# EAGLE design spectrometer (EAGLE 7.4.0)
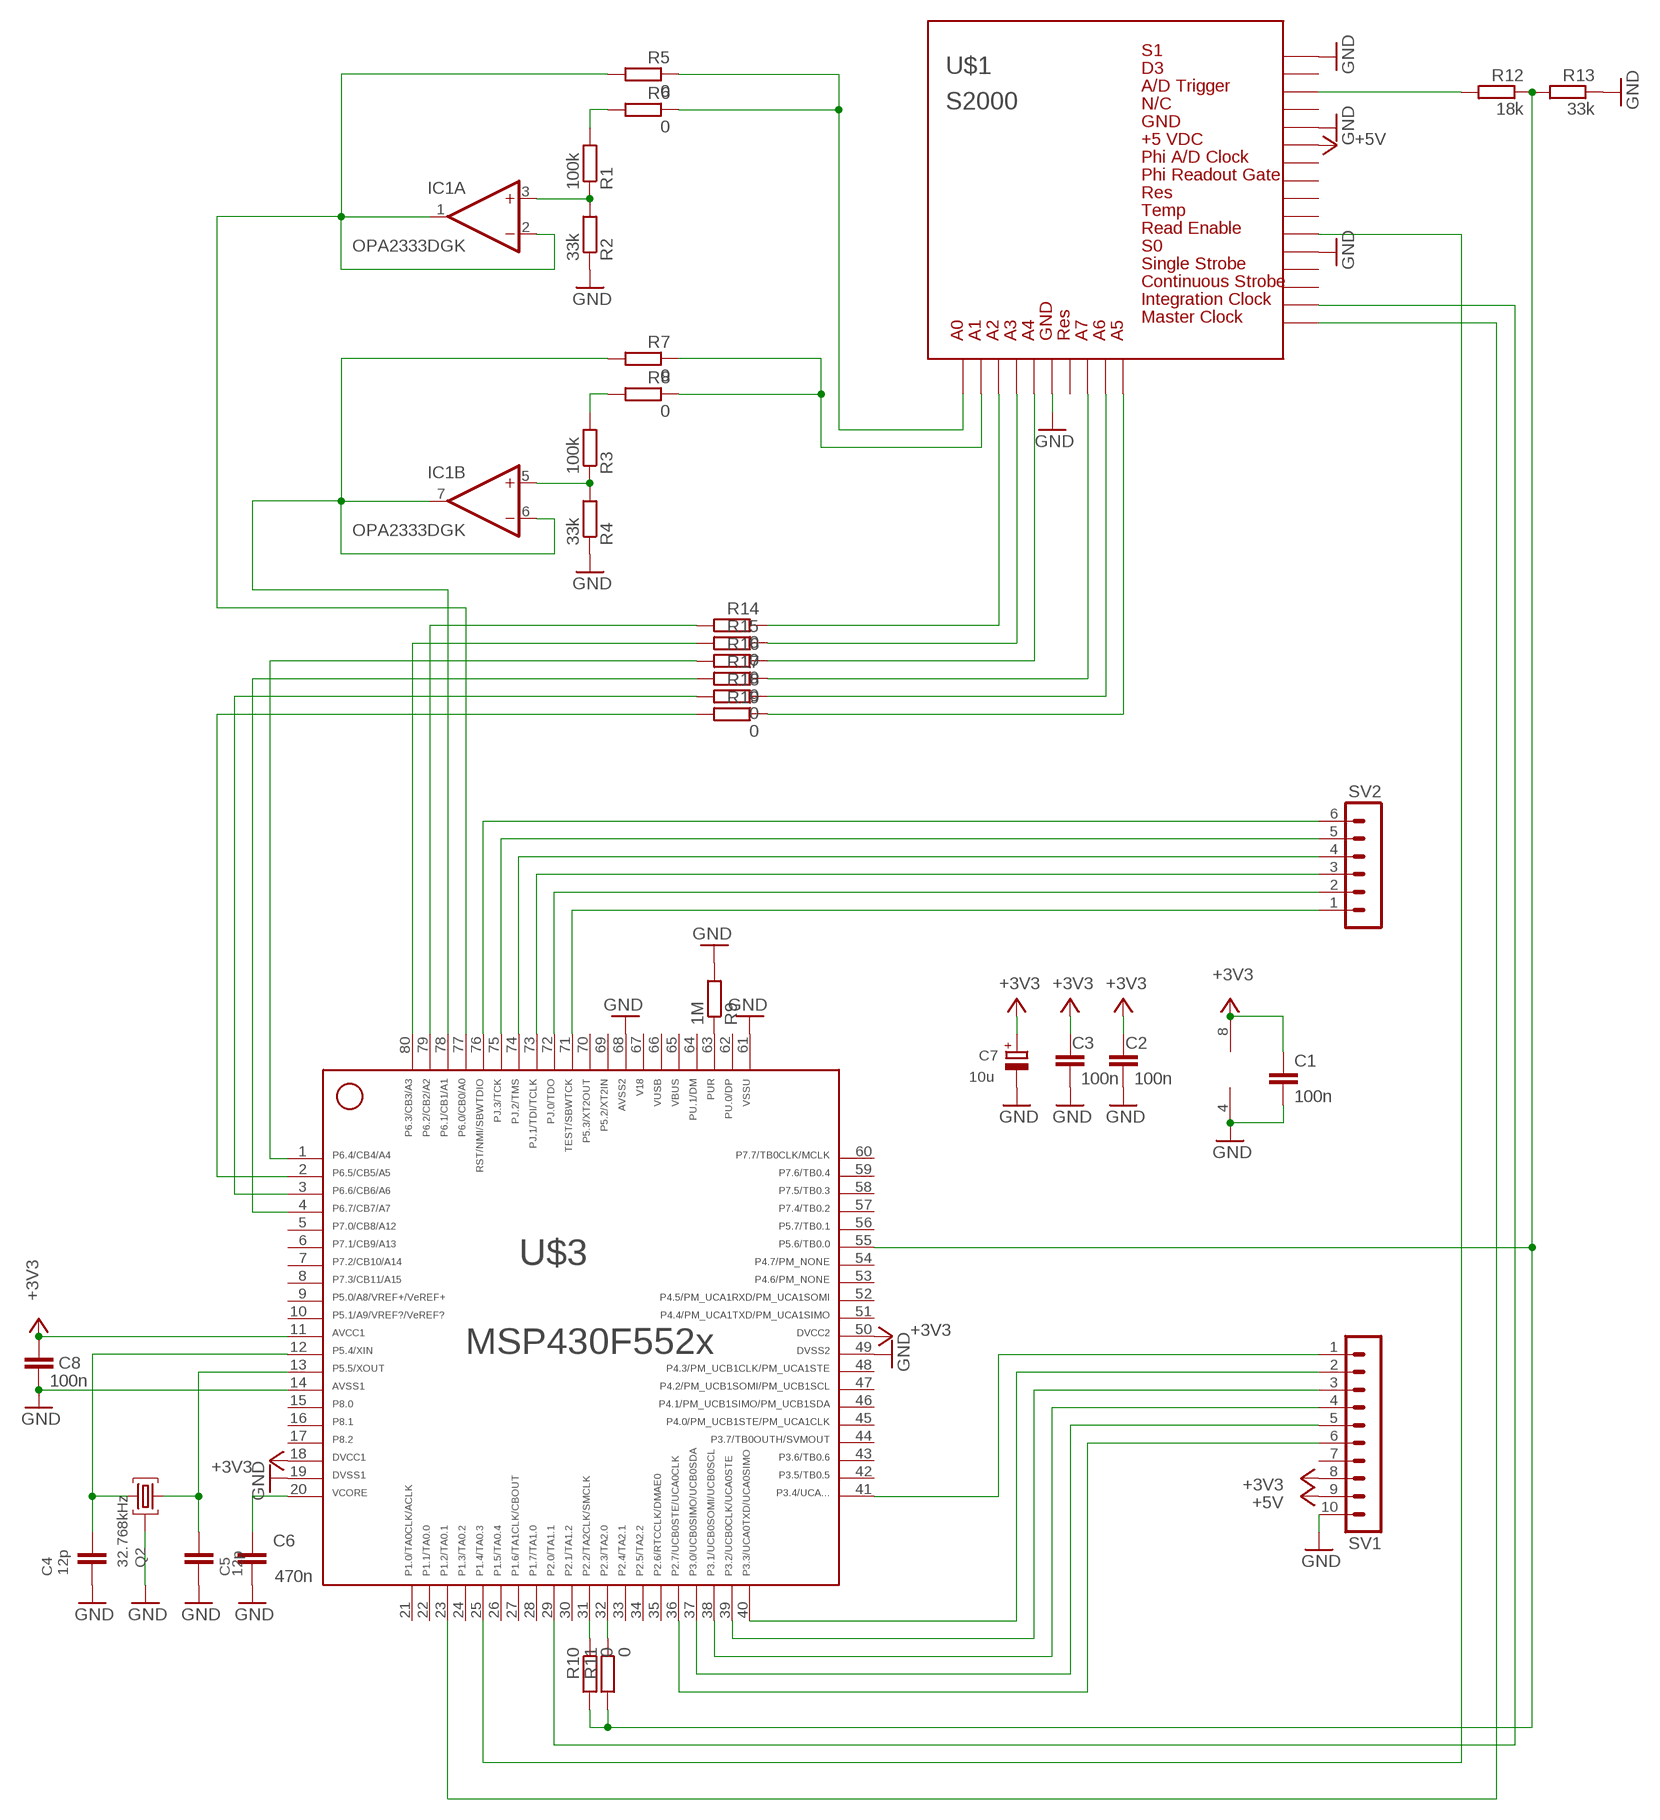
[diagram p0: schematic, sheet 1]

## Parts
C1  100n  C-EUC0603  [C0603]
C2  100n  C-EUC0603  [C0603]
C3  100n  C-EUC0603  [C0603]
C4  12p  C-EUC0603  [C0603]
C5  12p  C-EUC0603  [C0603]
C6  470n  C-EUC0603  [C0603]
C7  10u  CPOL-EUA/3216-18R  [A/3216-18R]
C8  100n  C-EUC0603  [C0603]
IC1  OPA2333DGK  [MSOP08]
Q2  32.768kHz  MS3V-T1R  [MS3V-T1R]
R1  100k  R-EU_R0603  [R0603]
R2  33k  R-EU_R0603  [R0603]
R3  100k  R-EU_R0603  [R0603]
R4  33k  R-EU_R0603  [R0603]
R5  0  R-EU_R0603  [R0603]
R6  0  R-EU_R0603  [R0603]
R7  0  R-EU_R0603  [R0603]
R8  0  R-EU_R0603  [R0603]
R9  1M  R-EU_R0603  [R0603]
R10  0  R-EU_R0603  [R0603]
R11  0  R-EU_R0603  [R0603]
R12  18k  R-EU_R0603  [R0603]
R13  33k  R-EU_R0603  [R0603]
R14  0  R-EU_R0603  [R0603]
R15  0  R-EU_R0603  [R0603]
R16  0  R-EU_R0603  [R0603]
R17  0  R-EU_R0603  [R0603]
R18  0  R-EU_R0603  [R0603]
R19  0  R-EU_R0603  [R0603]
SV1  MA10-1  [MA10-1]
SV2  MA06-1  [MA06-1]
U$1  S2000  [S2000]
U$3  F552X---PN80  [PN80]

## Nets
+3V3: C1.1 C2.2 C3.2 C7.+ C8.1 IC1.8(P:V+) SV1.8 U$3.11 U$3.18 U$3.50
+5V: SV1.9 U$1.H2$2
GND: C1.2 C2.1 C3.1 C4.1 C5.1 C6.1 C7.- C8.2 IC1.4(P:V-) Q2.P3(GND) R2.1 R4.1 R9.2 R13.1 SV1.10 U$1.H1$6 U$1.H2$1 U$1.H2$8 U$1.H2$A U$3.14 U$3.19 U$3.49 U$3.61 U$3.68
N$1: IC1.3(A:+IN) R1.1 R2.2
N$2: IC1.5(B:+IN) R3.1 R4.2
N$3: IC1.1(A:OUT) IC1.2(A:-IN) R5.2 U$3.77
N$4: IC1.6(B:-IN) IC1.7(B:OUT) R7.2 U$3.78
N$5: R1.2 R6.2
N$6: R3.2 R8.2
N$7: R5.1 R6.1 U$1.H1$1
N$8: R7.1 R8.1 U$1.H1$2
N$9: SV1.1 U$3.41
N$10: SV1.2 U$3.40
N$11: SV1.3 U$3.39
N$12: SV1.4 U$3.38
N$13: SV1.5 U$3.37
N$14: SV1.6 U$3.36
N$15: R14.2 U$3.79
N$16: R15.2 U$3.80
N$17: R16.2 U$3.1
N$18: R17.2 U$3.4
N$19: R18.2 U$3.3
N$20: R19.2 U$3.2
N$21: R9.1 U$3.63
N$22: SV2.1 U$3.71
N$23: SV2.2 U$3.72
N$24: SV2.3 U$3.73
N$25: SV2.4 U$3.74
N$26: SV2.5 U$3.75
N$27: SV2.6 U$3.76
N$28: U$1.H2$12 U$3.23
N$29: C4.2 Q2.P2 U$3.12
N$30: C6.2 U$3.20
N$31: C5.2 Q2.P1 U$3.13
N$32: U$1.H2$11 U$3.29
N$33: R10.1 U$3.31
N$34: R11.1 U$3.32
N$35: R10.2 R11.2 R12.1 R13.2 U$3.55
N$36: R14.1 U$1.H1$3
N$37: R12.2 U$1.H2$C
N$38: R15.1 U$1.H1$4
N$39: R16.1 U$1.H1$5
N$40: R17.1 U$1.H1$8
N$41: R18.1 U$1.H1$9
N$42: U$1.H2$7 U$3.25
N$43: R19.1 U$1.H1$10
Unconnected: SV1.7 U$1.H1$7 U$1.H2$3 U$1.H2$4 U$1.H2$5 U$1.H2$6 U$1.H2$9 U$1.H2$10 U$1.H2$B U$1.H2$D U$3.5 U$3.6 U$3.7 U$3.8 U$3.9 U$3.10 U$3.15 U$3.16 U$3.17 U$3.21 U$3.22 U$3.24 U$3.26 U$3.27 U$3.28 U$3.30 U$3.33 U$3.34 U$3.35 U$3.42 U$3.43 U$3.44 U$3.45 U$3.46 U$3.47 U$3.48 U$3.51 U$3.52 U$3.53 U$3.54 U$3.56 U$3.57 U$3.58 U$3.59 U$3.60 U$3.62 U$3.64 U$3.69 U$3.70

## Power pins joined to a net without a drawn wire
65: U$3.65
66: U$3.66
67: U$3.67

## Library data of the parts
C1-C6 C8 = rcl:C-EU: CAPACITOR, European symbol
C7 = rcl:CPOL-EU: POLARIZED CAPACITOR, European symbol
IC1 = linear:OPA2333: DUAL 1.8V, microPOWER CMOS OPERATIONAL AMPLIFIERS Zerø-Drift Series Source: Texas Instruments (Burr-Brown) .. U11 opa333 Operational Amp.pdf
Q2 = microcrystal:MS3V-T1R
R1-R19 = rcl:R-EU_: RESISTOR, European symbol
SV1 = con-lstb:MA10-1: PIN HEADER; OC_FARNELL: unknown; OC_NEWARK: unknown
SV2 = con-lstb:MA06-1: PIN HEADER; OC_FARNELL: unknown; OC_NEWARK: unknown
U$1 = Octanis1_EPS:S2000
U$3 = TI_MSP430_v16:F552X---PN80: ***MSP430F552X***PN80 http://www.ti.com/lit/gpn/msp430f5529 Rev1.0 06/2010 For F552X where X is 1,5,7,9

## Net classes
1 Ground: width 0.203 mm, drill 0.305 mm, clearance 0.152 mm
2 Power: width 0.203 mm, drill 0.305 mm, clearance 0.152 mm

## Board
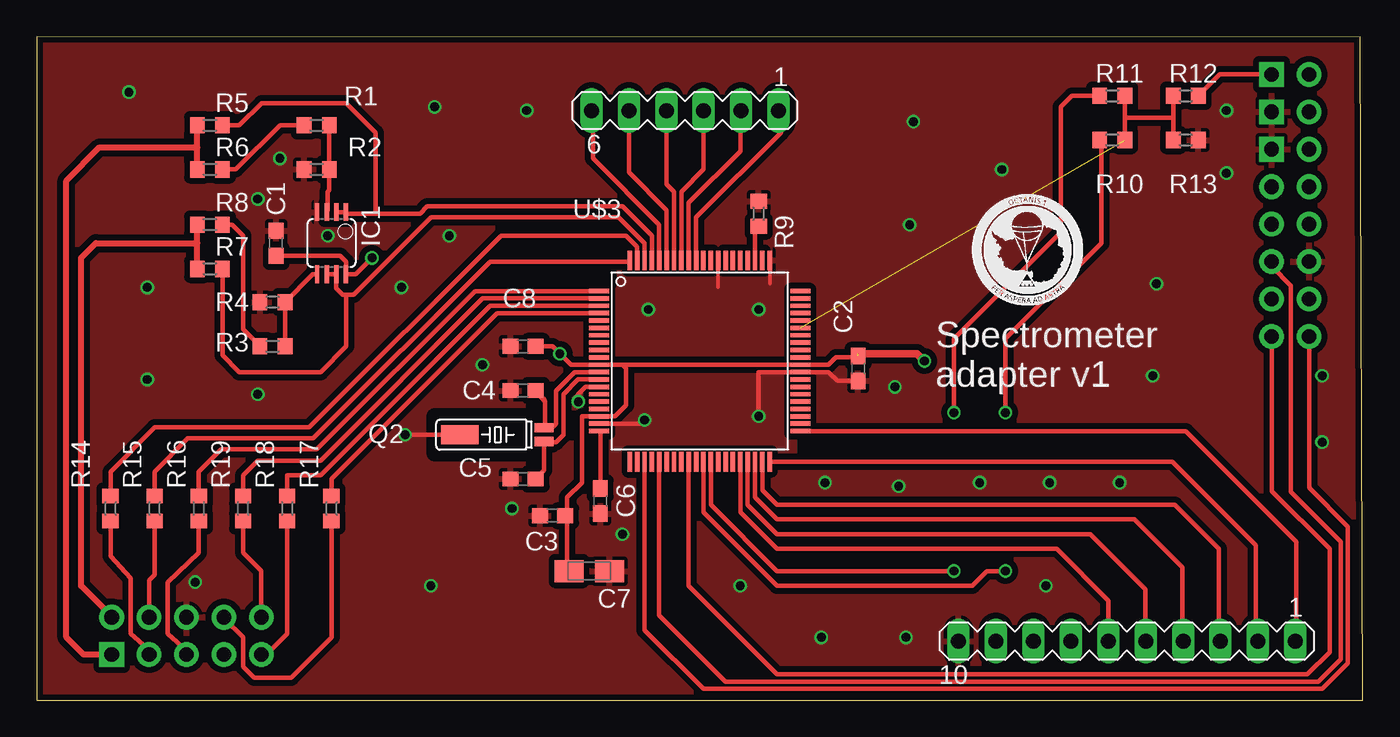
[diagram p1: board, top side]
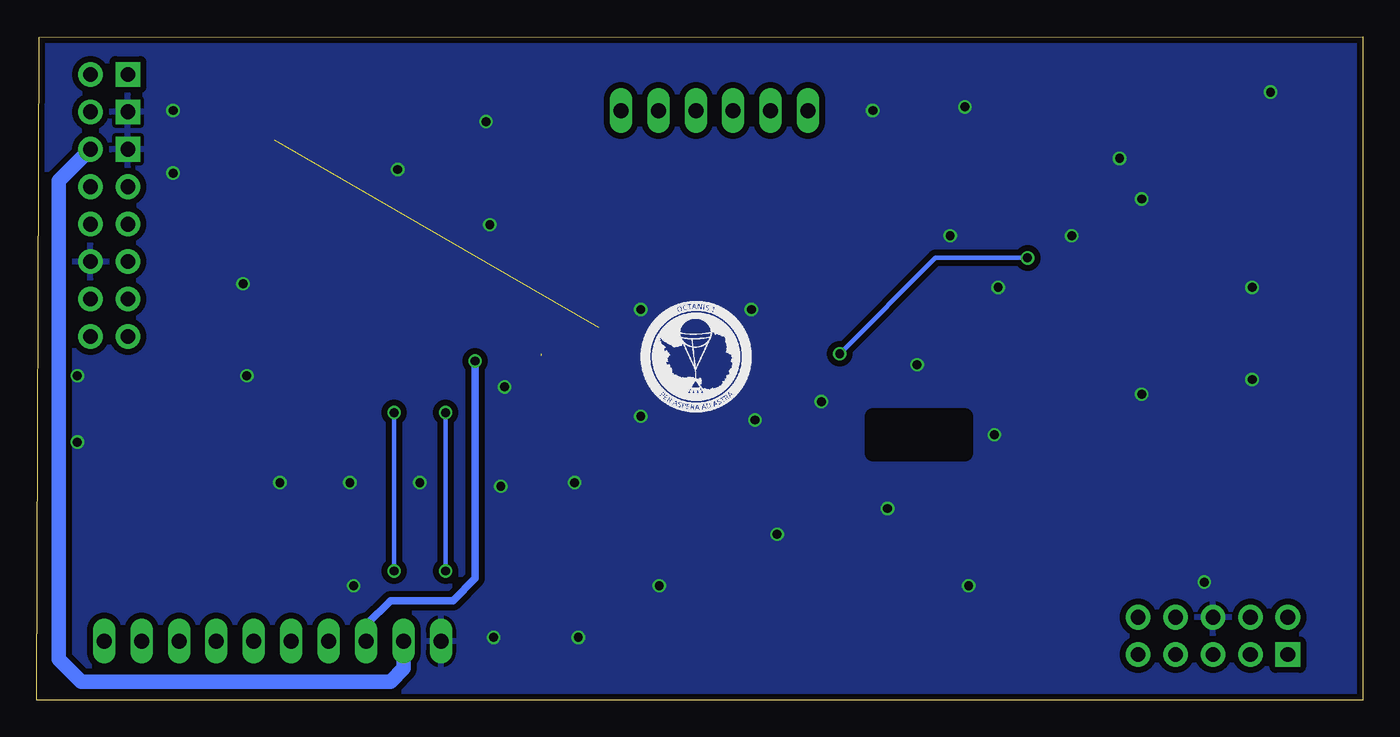
[diagram p2: board, bottom side, seen from below]

Size 90 x 45 mm. Coordinates in mm from the lower left corner, seen from the top.
Outline: 0,0 90,0 89.84,44.98 0,45 0,0
Copper layers (1*16): Top 0.035mm / dielectric 1.5mm / Bottom 0.035mm
Design rules "SeeedStudio_2layer_DRU_no_angle_20140221": minimum track width 6mil, minimum drill 12mil, track to track 6mil, track to pad 6mil, pad to pad 6mil, via to via 6mil, smd to smd 0mil, copper to edge 10mil, drill to drill 10mil, minimum pad ring 10mil, minimum via ring 6mil, stop-mask expansion 2mil, vias tented up to drill 100mil, thermal gap 10mil
tRestrict: area 27,16.8 to 33.5,19.2; area 52.2,16.8 to 52.5,17.8; area 38.2,28.2 to 38.8,29.2
bRestrict: area 27,16.8 to 33.2,19.2

### Footprints (pad centres in the part's own frame; a part is rotated, then mirrored left to right if it is on the bottom)
C0603 = smd 1.1 x 1: 1 -0.85,0; 2 0.85,0
A/3216-18R = smd 1.95 x 1.5: + 1.375,0; - -1.375,0
MSOP08 = smd 0.3 x 1.2: 1 -0.976,-2.113; 2 -0.326,-2.113; 3 0.324,-2.113; 4 0.974,-2.113; 5 0.974,2.112; 6 0.324,2.112; 7 -0.326,2.112; 8 -0.976,2.112
MS3V-T1R = smd 0.635 x 1.27: P1 -0.47,-4.43; P2 0.47,-4.43 | smd 1.27 x 2.54: P3 0,1.3
R0603 = smd 1 x 1.1: 1 -0.85,0; 2 0.85,0
MA10-1 = drill 1.016 long: 1 -11.43,0; 2 -8.89,0; 3 -6.35,0; 4 -3.81,0; 5 -1.27,0; 6 1.27,0; 7 3.81,0; 8 6.35,0; 9 8.89,0; 10 11.43,0
MA06-1 = drill 1.016 long: 1 -6.35,0; 2 -3.81,0; 3 -1.27,0; 4 1.27,0; 5 3.81,0; 6 6.35,0
S2000 = drill 1 pad 1.676 square: H1$1 0,0; H2$1 78.74,34.29; H2$A 78.74,36.83; H2$C 78.74,39.37 | drill 1 pad 1.676: H1$2 0,2.54; H1$3 2.54,0; H1$4 2.54,2.54; H1$5 5.08,0; H1$6 5.08,2.54; H1$7 7.62,0; H1$8 7.62,2.54; H1$9 10.16,0; H1$10 10.16,2.54; H2$2 81.28,34.29; H2$3 78.74,31.75; H2$4 81.28,31.75; H2$5 78.74,29.21; H2$6 81.28,29.21; H2$7 78.74,26.67; H2$8 81.28,26.67; H2$9 78.74,24.13; H2$10 81.28,24.13; H2$11 78.74,21.59; H2$12 81.28,21.59; H2$B 81.28,36.83; H2$D 81.28,39.37
PN80 = smd 1.35 x 0.3: 1 -6.825,4.75; 2 -6.825,4.25; 3 -6.825,3.75; 4 -6.825,3.25; 5 -6.825,2.75; 6 -6.825,2.25; 7 -6.825,1.75; 8 -6.825,1.25; 9 -6.825,0.75; 10 -6.825,0.25; 11 -6.825,-0.25; 12 -6.825,-0.75; 13 -6.825,-1.25; 14 -6.825,-1.75; 15 -6.825,-2.25; 16 -6.825,-2.75; 17 -6.825,-3.25; 18 -6.825,-3.75; 19 -6.825,-4.25; 20 -6.825,-4.75; 41 6.825,-4.75; 42 6.825,-4.25; 43 6.825,-3.75; 44 6.825,-3.25; 45 6.825,-2.75; 46 6.825,-2.25; 47 6.825,-1.75; 48 6.825,-1.25; 49 6.825,-0.75; 50 6.825,-0.25; 51 6.825,0.25; 52 6.825,0.75; 53 6.825,1.25; 54 6.825,1.75; 55 6.825,2.25; 56 6.825,2.75; 57 6.825,3.25; 58 6.825,3.75; 59 6.825,4.25; 60 6.825,4.75 | smd 0.3 x 1.35: 21 -4.75,-6.825; 22 -4.25,-6.825; 23 -3.75,-6.825; 24 -3.25,-6.825; 25 -2.75,-6.825; 26 -2.25,-6.825; 27 -1.75,-6.825; 28 -1.25,-6.825; 29 -0.75,-6.825; 30 -0.25,-6.825; 31 0.25,-6.825; 32 0.75,-6.825; 33 1.25,-6.825; 34 1.75,-6.825; 35 2.25,-6.825; 36 2.75,-6.825; 37 3.25,-6.825; 38 3.75,-6.825; 39 4.25,-6.825; 40 4.75,-6.825; 61 4.75,6.825; 62 4.25,6.825; 63 3.75,6.825; 64 3.25,6.825; 65 2.75,6.825; 66 2.25,6.825; 67 1.75,6.825; 68 1.25,6.825; 69 0.75,6.825; 70 0.25,6.825; 71 -0.25,6.825; 72 -0.75,6.825; 73 -1.25,6.825; 74 -1.75,6.825; 75 -2.25,6.825; 76 -2.75,6.825; 77 -3.25,6.825; 78 -3.75,6.825; 79 -4.25,6.825; 80 -4.75,6.825

### Placement (x,y rotation side)
C1  16.25,31 90 top
C2  55.75,22.5 90 top
C3  35,12.5 0 top
C4  33,21 0 top
C5  33,15 0 top
C6  38.25,13.5 90 top
C7  37.5,8.75 180 top
C8  33,24 180 top
IC1  20,31 180 top
Q2  30,18 90 top
R1  19,39 180 top
R2  19,36 0 top
R3  16,24 180 top
R4  16,27 0 top
R5  11.75,39 0 top
R6  11.75,36 0 top
R7  11.75,29.25 0 top
R8  11.75,32.25 0 top
R9  49,33 90 top
R10  73,38 0 top
R11  73,41 0 top
R12  78,41 0 top
R13  78,38 180 top
R14  5,13 90 top
R15  8,13 90 top
R16  11,13 90 top
R17  20,13 90 top
R18  17,13 90 top
R19  14,13 90 top
SV1  74,4 180 top
SV2  44,40 180 top
U$1  5.08,3.08 0 top
U$3  45,23 0 top

### Tracks (layer width: path | path; a pad name or v marks a point on that pad's centre or on a via)
+3V3  (via drill 0.6)  (1 unrouted)
  Top 0.3: C3.2 36,12.5 | 36,12.5 36,13.75 37,14.75 37,19.25 U$3.18 39.25,19.25 40,20 40,22.5 39.75,22.75 U$3.11 | C8.1 35,24 v35.5,23.5 36.25,22.75 U$3.11 | C2.2 55.65,23.25 54.25,23.25 53.75,22.75 U$3.50 U$3.11 | 36,12.5 36,8.88 C7.+ | C1.1 20.6,30.15 21,29.75 21,28.91 IC1.8 21.64,28.89 v22.75,30
  Top 0.5: 55.75,23.5 59.75,23.5 v60.25,23
  Bottom 0.3: v22.75,30 29,30 v35.5,23.5
  Bottom 0.5: SV1.8 67.65,5.1 66,6.75 61.75,6.75 60.25,8.25 v60.25,23
+5V
  Bottom 1: SV1.9 65.11,2.14 66,1.25 87,1.25 88.5,2.75 88.5,35.23 U$1.H2$2
GND  (via drill 0.6)
  Top 0.254: U$3.68 46.25,28 | U$3.61 49.75,28.25
  Top 0.3: C2.1 54.35,21.65 53.75,22.25 U$3.49 49,22.25 v49,19.25 | U$3.19 41.25,18.75 | v36.75,20.25 36.75,20.75 37.25,21.25 U$3.14 | v25,18 Q2.P3
  Top 0.406: 41.25,18.75 v41.25,19
  other vias: 26.75,7.75 30.25,22.75 39.75,11.25 32.25,13 16.5,36.75 19.75,31.5 15,34 10.75,8 80.75,40 80.75,35.75 59,4.25 53.25,4.25 47.75,7.75 68.5,7.75 87.25,22 87.25,17.5 76,28.25 75.75,22 59.5,39.25 59.25,32.25 65.5,36 58.25,21.25 27,40.25 33.25,40 41.5,26.5 49,26.5 6.25,41.25 7.5,28 7.5,21.75 15,20.75 24.75,28 53.5,14.75 58.5,14.5 64,14.75 68.75,14.75 73.5,14.75 28,31.5
  pour Top (isolate 0.406): -0.5,46.75 90,45 90,0 0,0
  pour Bottom (isolate 0.406): -5,45 90,45 90,0 0,0
N$1
  Top 0.3: IC1.3 19.75,33.19 19.75,34.5 19.85,34.6 R2.2 R1.1
N$2
  Top 0.3: R3.1 R4.2 18.74,28.89 IC1.5
N$3
  Top 0.3: U$3.77 41.75,31.5 39.75,33.5 26.5,33.5 26,33 23,33 | 23,33 21.09,33 IC1.1 IC1.2 | R5.2 13.75,39 15.25,40.5 21,40.5 23,38.5 23,33
N$4
  Top 0.3: 21,27.5 20.75,27.5 20.33,27.92 IC1.7 IC1.6 | 21,27.5 21.5,27.5 26.75,32.75 39.5,32.75 41.25,31 U$3.78 | R7.2 12.6,23.4 13.75,22.25 19.25,22.25 21,24 21,27.5
N$5
  Top 0.305: R1.2 16.5,39 13.5,36 R6.2
N$6
  Top 0.3: R8.2 13.25,32.25 14,31.5 14,25.15 R3.2
N$7
  Top 0.406: R6.1 10.9,37.5 | 10.9,37.5 R5.1 | U$1.H1$1 3.17,3.08 2,4.25 2,35.25 4.25,37.5 10.9,37.5
N$8
  Top 0.3: U$1.H1$2 5.08,5.67
  Top 0.406: R7.1 10.9,31 | 10.9,31 R8.1 | 5.08,5.67 3,7.75 3,30 4,31 10.9,31
N$9
  Top 0.3: SV1.1 85.5,4.07 85.5,10.75 78,18.25 U$3.41
N$10
  Top 0.3: SV1.2 82.75,4.14 82.75,10.5 77.08,16.18 U$3.40
N$11
  Top 0.3: SV1.3 80.25,4.1 80.25,10.25 77.25,13.25 50.25,13.25 49.25,14.25 U$3.39
N$12
  Top 0.3: U$3.38 48.75,13.75 50.25,12.25 74.5,12.25 77.75,9 77.75,4.06 SV1.4
N$13
  Top 0.3: U$3.37 48.25,13.25 50.25,11.25 71.5,11.25 75.25,7.5 75.25,4.02 SV1.5
N$14
  Top 0.3: U$3.36 47.75,12.75 50.25,10.25 69.25,10.25 72.75,6.75 72.75,4.02 SV1.6
N$15
  Top 0.3: U$3.79 40.75,30.75 40,31.5 31.5,31.5 18.5,18.5 8,18.5 5,15.5 R14.2
N$16
  Top 0.3: R15.2 8,15.5 10.25,17.75 18.75,17.75 30.75,29.75 40.17,29.75 U$3.80
N$17
  Top 0.3: R16.2 11,15.5 12.5,17 19,17 29.75,27.75 U$3.1
N$18
  Top 0.3: R17.2 20,15 31.25,26.25 U$3.4
N$19
  Top 0.3: R18.2 17,15.25 19.25,15.25 30.75,26.75 U$3.3
N$20
  Top 0.3: R19.2 14,15.25 15,16.25 19.25,16.25 30.25,27.25 U$3.2
N$21
  Top 0.3: U$3.63 48.75,31.9 R9.1
N$22
  Top 0.3: U$3.71 44.75,32.75 50.5,38.5 50.5,39.85 SV2.1
N$23
  Top 0.3: U$3.72 44.25,33.75 47.75,37.25 47.75,39.94 SV2.2
N$24
  Top 0.3: SV2.3 45.27,36.02 43.75,34.5 U$3.73
N$25
  Top 0.3: U$3.74 43.25,34.5 42.75,35 42.75,39.98 SV2.4
N$26
  Top 0.3: SV2.5 40.19,35.81 42.75,33.25 U$3.75
N$27
  Top 0.3: U$3.76 42.25,32.25 37.75,36.75 37.75,39.9 SV2.6
N$28
  Top 0.3: U$1.H2$12 86.36,14.39 89,11.75 89,2.5 87.25,0.75 45.25,0.75 41.25,4.75 U$3.23
N$29
  Top 0.3: U$3.12 36.5,22.25 35.25,21 35.25,18.75 35,18.5 34.46,18.5 Q2.P2 34.5,18.54 34.5,20.25 | 34.5,20.25 C4.2 | 34.43,20.43 34.5,20.25
N$30
  Top 0.3: C6.2 38.25,18.18 U$3.20
N$31
  Top 0.3: C5.2 34.43,15.58 Q2.P1 34.46,17.5 35.25,17.5 35.75,18 35.75,20.75 36.75,21.75 U$3.13
N$32
  Top 0.3: U$1.H2$11 83.82,14.18 87.75,10.25 87.75,3.25 86.25,1.75 50.25,1.75 44.25,7.75 U$3.29
N$33  (via drill 0.6)
  Top 0.3: 72.25,38 R10.1 72.25,37.9 72.25,31 65.75,24.5 v65.75,19.5 | v65.75,8.75 64.5,8.75 63.5,7.75 50.25,7.75 45.25,12.75 U$3.31
  Bottom 0.3: v65.75,19.5 v65.75,8.75
N$34  (via drill 0.6)
  Top 0.3: 72.25,41 R11.1 70.25,41 69.5,40.25 69.5,31.75 62.25,24.5 v62.25,19.5 | U$3.32 45.75,13.25 50.25,8.75 v62.25,8.75
  Bottom 0.3: v62.25,19.5 v62.25,8.75
N$35  (1 unrouted)
  Top 0.3: R13.2 77.15,39.5 | 77.15,39.5 R12.1 | R10.2 73.85,39.5 | 73.85,39.5 R11.2 | 73.85,39.5 77.15,39.5
N$36
  Top 0.3: U$1.H1$3 7.58,3.08 7.5,3 7.5,3.5 6.38,4.5 6.38,8.25 5,9.75 R14.1
N$37
  Top 0.3: U$1.H2$C 80.3,42.45 R12.2
N$38
  Top 0.3: U$1.H1$4 7.62,8.12 8,8.5 R15.1
N$39
  Top 0.3: U$1.H1$5 10.16,3.34 8.88,4.5 8.88,8 11,10 R16.1
N$40
  Top 0.3: U$1.H1$8 12.7,5.55 14,4.25 14,2.25 14.75,1.5 17.25,1.5 20,4.25 R17.1
N$41
  Top 0.3: U$1.H1$9 15.58,3.08 17,4.5 R18.1
N$42
  Top 0.3: U$1.H2$7 83.82,29.43 85.12,28.12 85.12,14.12 88.5,10.75 88.5,2.75 87,1.25 46.75,1.25 42.25,5.75 U$3.25
N$43
  Top 0.3: U$1.H1$10 15.24,8.76 14,10 R19.1

### Text on the board
tNames: Spectrometer / adapter v1
tValues: A/D-trig | S1 | A0 | GND | +5V | RST | TST | A0/4 | A1/4 | Read Enable | S0 | A1 | M | Int CLK | CLK | A2 | A3 | A4 | A5 | A6 | A7 | GND | STE B0 | SIMO / SDA B0 | SOMI / SCL B0 | CLK B0 | Tx A0 | Rx A0 | A1 | A3 | A7 | A5 | GND | +5V | +3.3V | A0 | A2 | A4 | A6